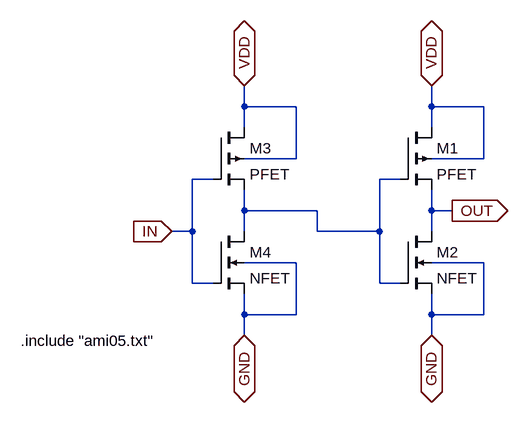
[diagram p0: schematic buffer.asc]
buffer.asc, the LTspice schematic file:
Version 4
SHEET 1 880 680
WIRE 48 -80 48 -112
WIRE 128 -80 48 -80
WIRE 336 -80 336 -112
WIRE 416 -80 336 -80
WIRE 48 -48 48 -80
WIRE 336 -48 336 -80
WIRE 128 0 128 -80
WIRE 128 0 48 0
WIRE 416 0 416 -80
WIRE 416 0 336 0
WIRE 0 32 -32 32
WIRE 288 32 256 32
WIRE 48 80 48 48
WIRE 160 80 48 80
WIRE 336 80 336 48
WIRE 368 80 336 80
WIRE -32 112 -32 32
WIRE -32 112 -64 112
WIRE 48 112 48 80
WIRE 160 112 160 80
WIRE 256 112 256 32
WIRE 256 112 160 112
WIRE 336 112 336 80
WIRE 128 160 48 160
WIRE 416 160 336 160
WIRE -32 192 -32 112
WIRE 0 192 -32 192
WIRE 256 192 256 112
WIRE 288 192 256 192
WIRE 48 240 48 208
WIRE 128 240 128 160
WIRE 128 240 48 240
WIRE 336 240 336 208
WIRE 416 240 416 160
WIRE 416 240 336 240
WIRE 48 272 48 240
WIRE 336 272 336 240
FLAG 336 -112 VDD
IOPIN 336 -112 BiDir
FLAG 336 272 GND
IOPIN 336 272 BiDir
FLAG 368 80 OUT
IOPIN 368 80 Out
FLAG 48 -112 VDD
IOPIN 48 -112 BiDir
FLAG 48 272 GND
IOPIN 48 272 BiDir
FLAG -64 112 IN
IOPIN -64 112 In
SYMBOL pmos4 288 -48 R0
SYMATTR InstName M1
SYMATTR Value PFET
SYMATTR Value2 l=0.6u w=3u
SYMBOL nmos4 288 112 R0
SYMATTR InstName M2
SYMATTR Value NFET
SYMATTR Value2 l=0.6u w=1.5u
SYMBOL pmos4 0 -48 R0
SYMATTR InstName M3
SYMATTR Value PFET
SYMATTR Value2 l=0.6u w=3u
SYMBOL nmos4 0 112 R0
SYMATTR InstName M4
SYMATTR Value NFET
SYMATTR Value2 l=0.6u w=1.5u
TEXT -296 280 Left 2 !.include "ami05.txt"

The netlist it stands for:
* buffer.asc
M1 VDD N001 OUT VDD PFET l=0.6u w=3u
M2 OUT N001 GND GND NFET l=0.6u w=1.5u
M3 VDD IN N001 VDD PFET l=0.6u w=3u
M4 N001 IN GND GND NFET l=0.6u w=1.5u
.model NMOS NMOS
.model PMOS PMOS
.lib standard.mos
.include "ami05.txt"
.backanno
.end